# EAGLE design voltage_sensor_v0.6 (EAGLE 9.6.2)
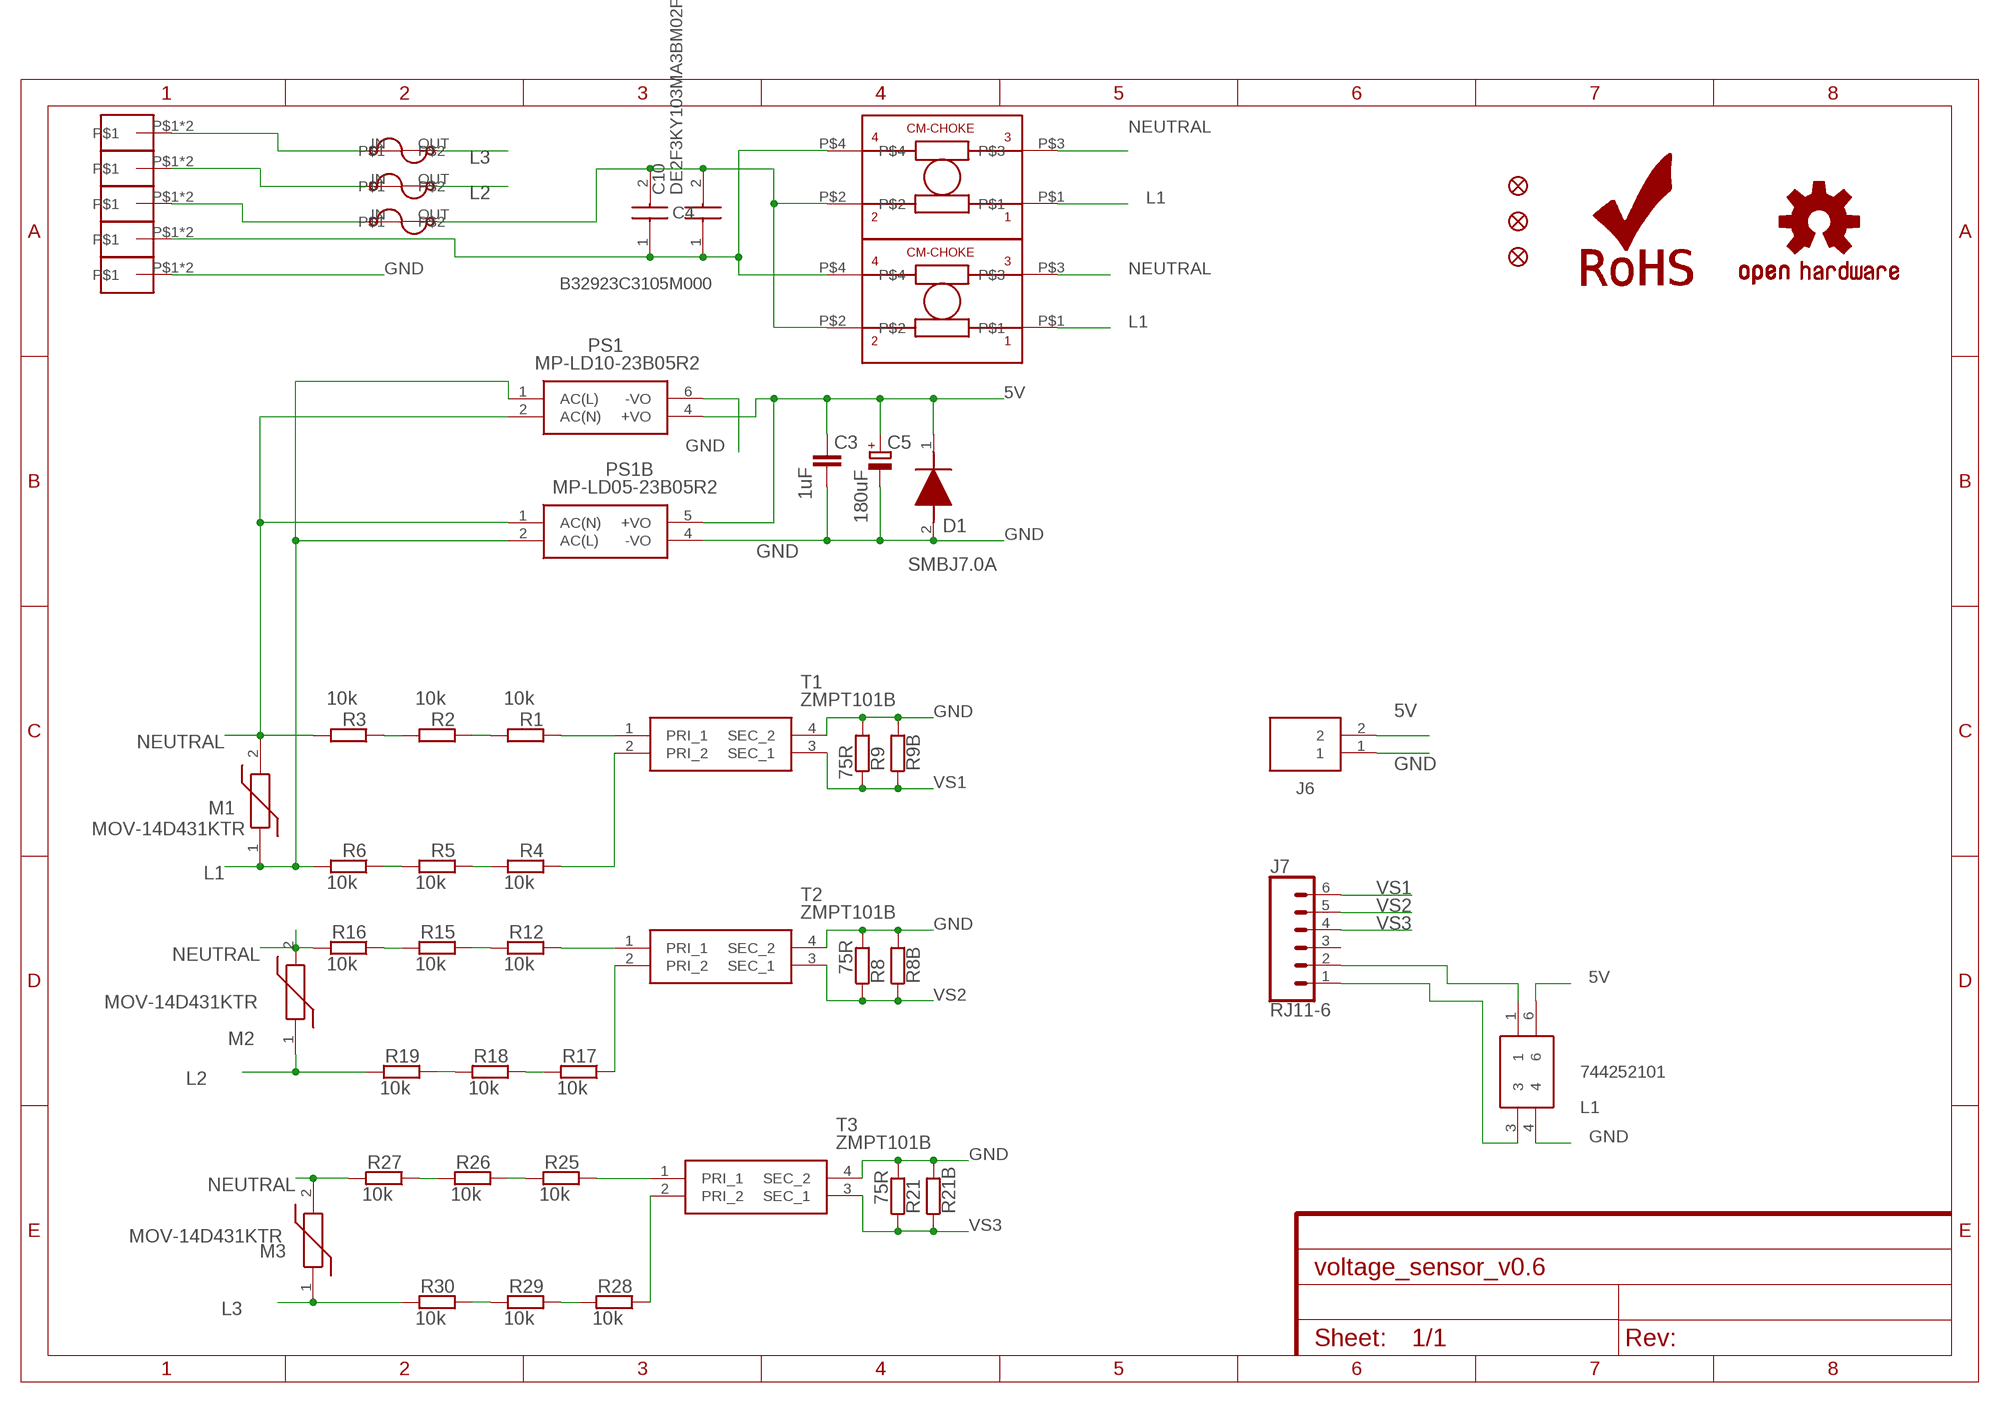
[diagram p0: schematic, sheet 1]

## Parts
C3  1uF  C-EUC0603  [C0603]
C4  B32923C3105M000  [B32923C_(26.5_X_12)]
C5  180uF  CPOL-EUC  [PANASONIC_C]
C10  DE2F3KY103MA3BM02F  [DE2F3KY103MA3BM02F]
D1  SMBJ7.0A  [DIOM5336X244N]
F1  2A/250V  BEL1AFUSE  [BELFUSE1A]
F2  2A/250V  BEL1AFUSE  [BELFUSE1A]
F3  2A/250V  BEL1AFUSE  [BELFUSE1A]
FD1  FIDUCIAL1X2  [FIDUCIAL-1X2]
FD2  FIDUCIAL1X2  [FIDUCIAL-1X2]
FD3  FIDUCIAL1X2  [FIDUCIAL-1X2]
J1  1905010  [1905010]
J3  1905010  [1905010]
J4  1905010  [1905010]
J5  1905010  [1905010]
J6  20020316-H021B01LF  [20020316H021B01LF]
J7  RJ11-6  [RJ11-6]
L1  744252101  [744252101]
LOGO1  ROHS_LOGO  [ROHS_LOGO_0.18_IN]
LOGO2  OSHW-LOGOS-COPPER  [OSHW-LOGO-S_COPPER]
M1  MOV-14D431KTR  [MOV14D431KTR]
M2  MOV-14D431KTR  [MOV14D431KTR]
M3  MOV-14D431KTR  [MOV14D431KTR]
PS1  MP-LD10-23B05R2  MP-LD10-23B12R2  [MPLD1023B12R2]
PS1B  MP-LD05-23B05R2  MP-LD05-23B03R2  [MPLD0523B03R2]
R1  10k  R-EU_R0603  [R0603]
R2  10k  R-EU_R0603  [R0603]
R3  10k  R-EU_R0603  [R0603]
R4  10k  R-EU_R0603  [R0603]
R5  10k  R-EU_R0603  [R0603]
R6  10k  R-EU_R0603  [R0603]
R8  75R  R-EU_R0603  [R0603]
R8B  R-EU_0204/7  [0204/7]
R9  75R  R-EU_R0603  [R0603]
R9B  R-EU_0204/7  [0204/7]
R12  10k  R-EU_R0603  [R0603]
R15  10k  R-EU_R0603  [R0603]
R16  10k  R-EU_R0603  [R0603]
R17  10k  R-EU_R0603  [R0603]
R18  10k  R-EU_R0603  [R0603]
R19  10k  R-EU_R0603  [R0603]
R21  75R  R-EU_R0603  [R0603]
R21B  R-EU_0204/7  [0204/7]
R25  10k  R-EU_R0603  [R0603]
R26  10k  R-EU_R0603  [R0603]
R27  10k  R-EU_R0603  [R0603]
R28  10k  R-EU_R0603  [R0603]
R29  10k  R-EU_R0603  [R0603]
R30  10k  R-EU_R0603  [R0603]
T1  ZMPT101B  [ZMPT101B]
T2  ZMPT101B  [ZMPT101B]
T3  ZMPT101B  [ZMPT101B]
U$1  47mH  RN114-0.3-02-47M  [RN114-0.3-02-47M]
U$1B  RN214-0.3-02-47M  [RN214-0.3-02-47M]
U$6  1905010  [1905010]

## Nets
5V: C3.1 C5.+ D1.1(K) J6.2 L1.6 PS1.4(+VO) PS1B.5(+VO)
GND: C3.2 C5.- D1.2(A) J1.P$1 J1.P$2 J6.1 L1.4 PS1.6(-VO) PS1B.4(-VO) R8.2 R8B.2 R9.2 R9B.2 R21.2 R21B.2 T1.4(SEC_2) T2.4(SEC_2) T3.4(SEC_2)
L1: M1.1 PS1.1(AC(L)) PS1B.2(AC(L)) R6.2 U$1.P$1 U$1B.P$1
L2: F2.OUT M2.1 R19.2
L3: F3.OUT M3.1 R30.2
N$1: R1.1 T1.1(PRI_1)
N$2: R4.1 T1.2(PRI_2)
N$3: R1.2 R2.1
N$4: R4.2 R5.1
N$5: R5.2 R6.1
N$6: R2.2 R3.1
N$7: F1.IN J3.P$1 J3.P$2
N$8: F2.IN J4.P$1 J4.P$2
N$10: R12.1 T2.1(PRI_1)
N$11: R17.1 T2.2(PRI_2)
N$12: R12.2 R15.1
N$13: R17.2 R18.1
N$14: R18.2 R19.1
N$15: R15.2 R16.1
N$16: F3.IN J5.P$1 J5.P$2
N$18: J7.2 L1.1
N$19: R25.1 T3.1(PRI_1)
N$20: R28.1 T3.2(PRI_2)
N$21: R25.2 R26.1
N$22: R28.2 R29.1
N$23: R29.2 R30.1
N$24: R26.2 R27.1
N$27: J7.1 L1.3
N$28: C4.1 C10.1 U$1.P$4 U$1B.P$4 U$6.P$1 U$6.P$2
N$29: C4.2 C10.2 F1.OUT U$1.P$2 U$1B.P$2
NEUTRAL: M1.2 M2.2 M3.2 PS1.2(AC(N)) PS1B.1(AC(N)) R3.2 R16.2 R27.2 U$1.P$3 U$1B.P$3
VS1: J7.6 R9.1 R9B.1 T1.3(SEC_1)
VS2: J7.5 R8.1 R8B.1 T2.3(SEC_1)
VS3: J7.4 R21.1 R21B.1 T3.3(SEC_1)
Unconnected: J7.3

## Library data of the parts
C3 = resistor:C-EU: CAPACITOR, European symbol
C4 = B32923C3105M000:B32923C3105M000: EPCOS - B32923C3105M000 - Safety Capacitor, 1 ?F, X2, B32923C Series, 305 V, Metallized PP Source: Datasheet <https://product.tdk.com/system/files/dam/doc/product/capacitor/film/emi/data_sheet/20/20/db/fc_2009/x2_b32921_928.pdf>; ARROW_PART_NUMBER: B32923C3105M000; ARROW_PRICE-STOCK: https://www.arrow.com/en/products/b32923c3105m000/epcos-tdk; DESCRIPTION: EPCOS - B32923C3105M000 - Safety Capacitor, 1 ?F, X2, B32923C Series, 305 V, Metallized PP; HEIGHT: mm; MANUFACTURER_NAME: TDK; MANUFACTURER_PART_NUMBER: B32923C3105M000
C5 = rcl:CPOL-EU: POLARIZED CAPACITOR, European symbol; SPICEPREFIX: C
C10 = DE2F3KY103MA3BM02F:DE2F3KY103MA3BM02F: Murata Single Layer Ceramic Capacitor SLCC 10nF 250Vrms +/-20% F Dielectric DE2 Series +85C Max Op. Temp. Source: Datasheet <https://psearch.en.murata.com/capacitor/product/DE2F3KY103MA3BM02F.html>; ARROW_PART_NUMBER: DE2F3KY103MA3BM02F; ARROW_PRICE-STOCK: https://www.arrow.com/en/products/de2f3ky103ma3bm02f/murata-manufacturing; DESCRIPTION: Murata Single Layer Ceramic Capacitor SLCC 10nF 250Vrms +/-20% F Dielectric DE2 Series +85C Max Op. Temp.; HEIGHT: 17mm; MANUFACTURER_NAME: Murata Electronics; MANUFACTURER_PART_NUMBER: DE2F3KY103MA3BM02F; MOUSER_PART_NUMBER: 81-DE2F3KY103MA3BM2F; MOUSER_PRICE-STOCK: https://www.mouser.co.uk/ProductDetail/Murata-Electronics/DE2F3KY103MA3BM02F?qs=coxMWmu44UCpS%2FqDCKay7w%3D%3D
D1 = SMBJ7.0A:SMBJ7.0A: TVS, SMD, 600W, 7V HY Electronic Corp SMBJ7.0A Uni-Directional TVS Diode, 600 (Min.)W peak, 2-Pin SMB Source: Datasheet; DESCRIPTION: TVS, SMD, 600W, 7V HY Electronic Corp SMBJ7.0A Uni-Directional TVS Diode, 600 (Min.)W peak, 2-Pin SMB; HEIGHT: 2.44mm; MANUFACTURER_NAME: HY Electronic Corp; MANUFACTURER_PART_NUMBER: SMBJ7.0A
F1-F3 = Qxd:BEL1AFUSE
FD1-FD3 = SparkFun-Aesthetics:FIDUCIAL: Fiducial Alignment Points Point-of-reference for pick-and-place machines and other optical instruments.
J1 J3-J5 U$6 = Phoenix-Contact-1905010:1905010: PCB terminal block, nominal current: 24 A, rated voltage (III/2): 400 V, nominal cross section: 2.5 mm 2 , number of potentials: 1, number of rows: 1, number of positions per row: 1, product range: ZFKDS(A) 2,5, pitch: 5.08 mm, connection method: Spring-cage connection, conductor/PCB connection direction: 45 °, color: green, Pin layout: Linear pinning, Solder pin [P]: 3.5 mm, number of solder pins per potential: 2, type of packaging: packed in cardboard. The article can be aligned to create different nos. of positions!
J6 = 20020316-H021B01LF:20020316-H021B01LF: Conn Pluggable Terminal Block 2 POS 5.08mm Screw RA Thru-Hole 16A/Contact Box Source: Datasheet <https://datasheet.datasheetarchive.com/originals/distributors/Datasheets-DGA18/1074774.pdf>; ARROW_PART_NUMBER: 20020316-H021B01LF; ARROW_PRICE-STOCK: https://www.arrow.com/en/products/20020316-h021b01lf/amphenol; DESCRIPTION: Conn Pluggable Terminal Block 2 POS 5.08mm Screw RA Thru-Hole 16A/Contact Box; HEIGHT: 13.8mm; MANUFACTURER_NAME: Amphenol; MANUFACTURER_PART_NUMBER: 20020316-H021B01LF; MOUSER_PART_NUMBER: N/A; MOUSER_PRICE-STOCK: https://www.mouser.co.uk/ProductDetail/Amphenol/20020316-H021B01LF?qs=W0yvOO0ixfFlV4eKhSWD3Q%3D%3D
J7 = SparkFun-Connectors:RJ11-6: RJ11 Jack - 6 pin Commonly found on CAT3 devices and some Microchip programmers. Here is the connector we sell at SparkFun: RJ11 6-Pin Connector <https://www.sparkfun.com/products/132> (PRT-00132) Datasheet <http://www.sparkfun.com/datasheets/Prototyping/Connectors/RJ11-Datasheet.pdf> It is used on this SparkFun product: SparkFun Weather Shield <https://www.sparkfun.com/products/12081> (DEV-12081) Weather Meters <https://www.sparkfun.com/products/8942> (SEN-08942); PROD_ID: CONN-08590; SF_ID: PRT-00132; VALUE: RJ11
L1 = 744252101:744252101: Common Mode Choke WE-SL3 2x100uH 0.5A Wurth WE-SL3 Series Wire-wound SMD Inductor with a Ferrite Core, 100 uH +50/-30 Bifilar Winding 500mA Idc Source: Datasheet <https://datasheet.datasheetarchive.com/originals/distributors/Datasheets_SAMA/813b8c68731e2e4ca9c504a5a5705204.pdf>; DESCRIPTION: Common Mode Choke WE-SL3 2x100uH 0.5A Wurth WE-SL3 Series Wire-wound SMD Inductor with a Ferrite Core, 100 uH +50/-30 Bifilar Winding 500mA Idc; HEIGHT: 2.5mm; MANUFACTURER_NAME: Wurth Elektronik; MANUFACTURER_PART_NUMBER: 744252101; MOUSER_PART_NUMBER: 710-744252101; MOUSER_PRICE-STOCK: https://www.mouser.co.uk/ProductDetail/Wurth-Elektronik/744252101?qs=T3oQrply3y%2FhsB6zILUctg%3D%3D
LOGO1 = SparkFun-Aesthetics:ROHS_LOGO: Restriction of Hazardous Substances (RoHS) Logo Logo for RoHS-certified hardware.
LOGO2 = SparkFun-Aesthetics:OSHW-LOGO: Open-Source Hardware (OSHW) Logo This logo indicates the piece of hardware it is found on incorporates a OSHW license and/or adheres to the definition of open source hardware found here: http://freedomdefined.org/OSHW
M1-M3 = MOV-14D431KTR:MOV-14D431KTR: Var MOV 275VAC/350VDC 4500A 430V Thru-Hole Radial T/R Source: Datasheet <https://componentsearchengine.com/Datasheets/2/MOV-14D431KTR.pdf>; ARROW_PART_NUMBER: MOV-14D431KTR; ARROW_PRICE-STOCK: https://www.arrow.com/en/products/mov-14d431ktr/bourns; DESCRIPTION: Var MOV 275VAC/350VDC 4500A 430V Thru-Hole Radial T/R; HEIGHT: 20mm; MANUFACTURER_NAME: Bourns; MANUFACTURER_PART_NUMBER: MOV-14D431KTR; MOUSER_PART_NUMBER: 652-MOV-14D431KTR; MOUSER_PRICE-STOCK: https://www.mouser.co.uk/ProductDetail/Bourns/MOV-14D431KTR?qs=CQ3B1E%252BbPs0ZvUvqcBsPRw%3D%3D
PS1 = MP-LD10-23B12R2:MP-LD10-23B12R2: MULTICOMP PRO - MP-LD10-23B05R2 - AC/DC PCB Mount Power Supply (PSU), 100 to 430VDC, ITE, Household, Medical & Transformers, 5V Output Source: Datasheet <https://componentsearchengine.com/Datasheets/2/MP-LD10-23B05R2.pdf>; DESCRIPTION: MULTICOMP PRO - MP-LD10-23B12R2 - AC/DC PCB Mount Power Supply (PSU), 100 to 430VDC, ITE, Household, Medical & Transformers, 1 Output; HEIGHT: 21.5mm; MANUFACTURER_NAME: MULTICOMP; MANUFACTURER_PART_NUMBER: MP-LD10-23B05R2
PS1B = MP-LD05-23B03R2:MP-LD05-23B03R2: POWER SUPPLY, AC-DC, 3.3V, 1.515A Source: Datasheet <https://www.farnell.com/datasheets/3167202.pdf>; DESCRIPTION: POWER SUPPLY, AC-DC, 3.3V, 1.515A; HEIGHT: 18.1mm; MANUFACTURER_NAME: MULTICOMP; MANUFACTURER_PART_NUMBER: MP-LD05-23B03R2
R1-R6 R8 R8B R9 R9B R12 R15-R19 R21 R21B R25-R30 = rcl:R-EU_: RESISTOR, European symbol
T1-T3 = ZMPT101B:ZMPT101B: Current-type Voltage Transformer Source: Datasheet; DESCRIPTION: Current-type Voltage Transformer; HEIGHT: 18.8mm; MANUFACTURER_NAME: Qingxian Zeming Langxi Electronic; MANUFACTURER_PART_NUMBER: ZMPT101B
U$1 = Schaffner-CM-Choke:RN114-0.3-02-47M
U$1B = Schaffner-CM-Choke:RN214-0.3-02-47M

## Net classes
0 default: clearance 0.205 mm
1 power: width 0.305 mm, drill 0.6 mm, clearance 0.254 mm
2 gnd: width 0.254 mm, drill 0.6 mm, clearance 0.254 mm

## Board
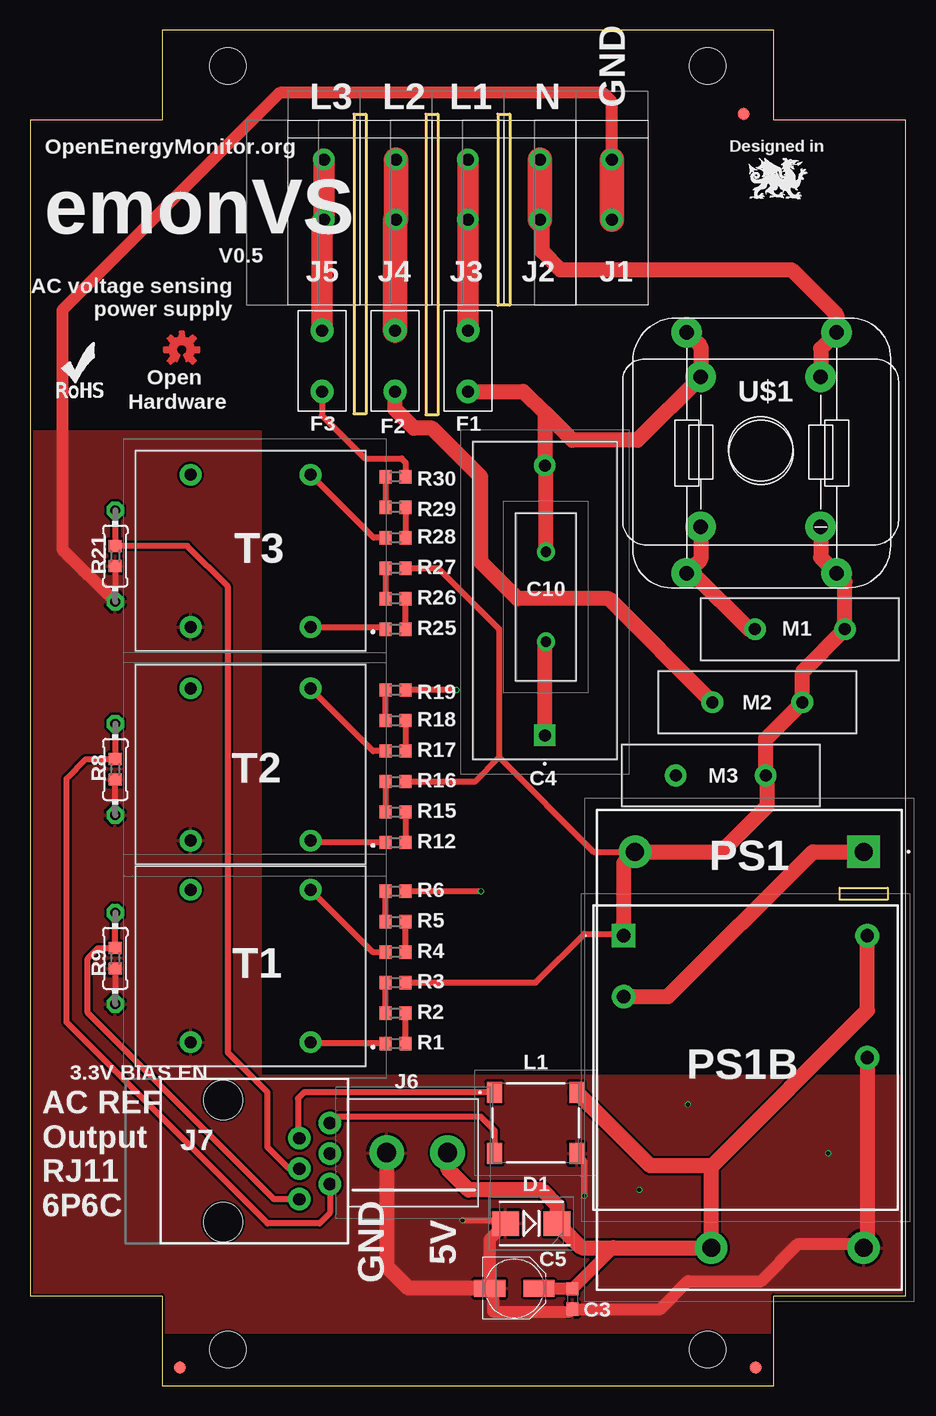
[diagram p1: board, top side]
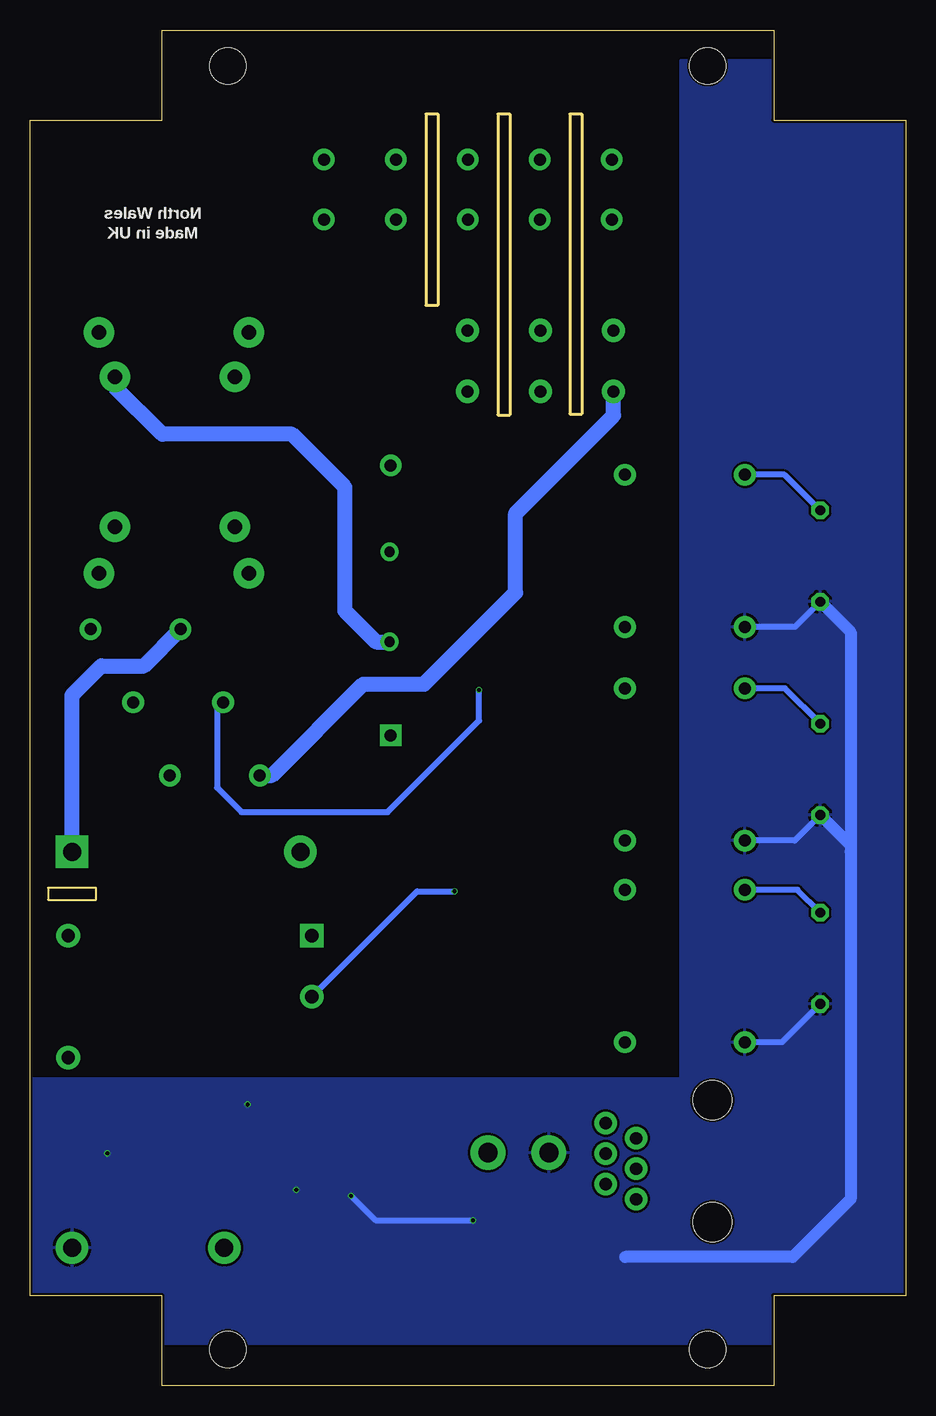
[diagram p2: board, bottom side, seen from below]

Size 73 x 113 mm. Coordinates in mm from the lower left corner, seen from the top.
Outline: 0,7.5 11,7.5 11,0 62,0 62,7.5 73,7.5 73,105.5 62,105.5 62,113 11,113 11,105.5 0,105.5 0,7.5
Copper layers (1*16): Top 0.035mm / dielectric 1.6mm / Bottom 0.035mm
Design rules "jlcpcb-2layers": minimum track width 5mil, minimum drill 0.3mm, track to track 5mil, track to pad 5mil, pad to pad 5mil, via to via 5mil, smd to smd 5mil, copper to edge 0.2mm, drill to drill 6mil, minimum pad ring 10mil, minimum via ring 3mil, stop-mask expansion 4mil, vias tented up to drill 0mil, thermal gap 10mil
Holes 3 mm at 16.5,3 16.5,110 56.5,3 56.5,110
tKeepout: area 13.5,0 to 19.5,6; area 53.5,0 to 59.5,6; area 53.5,107 to 59.5,113; area 13.5,107 to 19.5,113; area 25,108.5 to 48.5,113; area 25,0 to 48.5,4.5
Milling: 16 lines

### Footprints (pad centres in the part's own frame; a part is rotated, then mirrored left to right if it is on the bottom)
C0603 = smd 1.1 x 1: 1 -0.85,0; 2 0.85,0
B32923C_(26.5_X_12) = drill 1 pad 1.5 square: 1 0,0 | drill 1 pad 1.5: 2 22.5,0
PANASONIC_C = smd 2.6 x 1.4: + 2.05,0; - -2.05,0
DE2F3KY103MA3BM02F = drill 0.85 pad 1.381: 1 0,0; 2 7.5,0
DIOM5336X244N = smd 2.25 x 2.05: 1 -2.15,0; 2 2.15,0
BELFUSE1A = drill 1 pad 1.93: IN 2,1.66; OUT 2,6.74
FIDUCIAL-1X2 = smd 1 x 1: 1 0,0
1905010 = drill 1: P$1 3,3.3; P$2 3,8.3
20020316H021B01LF = drill 1.6 pad 2.4: 1 0,0; 2 5.08,0
RJ11-6 = drill 1.016 pad 1.88: 1 -3.175,8.89; 2 -1.905,6.35; 3 -0.635,8.89; 4 0.635,6.35; 5 1.905,8.89; 6 3.175,6.35 | hole 3.251: -5.08,0; 5.08,0
744252101 = smd 1.78 x 1.27: 1 -2.54,-3.43; 3 2.54,-3.43; 4 2.54,3.43; 6 -2.54,3.43
MOV14D431KTR = drill 1 pad 1.5: 1 0,0; 2 7.5,0
MPLD1023B12R2 = drill 1.5 pad 2.25 square: 1 0,0 | drill 1.5 pad 2.25: 2 0,-19.05; 4 33.02,-12.705; 6 33.02,0
MPLD0523B03R2 = drill 1.1 pad 1.65 square: 1 0,0 | drill 1.1 pad 1.65: 2 0,-5.08; 4 20.32,-10.16; 5 20.32,0
R0603 = smd 1 x 1.1: 1 -0.85,0; 2 0.85,0
0204/7 = drill 0.813 octagon: 1 -3.81,0; 2 3.81,0
ZMPT101B = drill 1 pad 1.5: 1 0,0; 2 0,-12.7; 3 10,-12.7; 4 10,0
RN114-0.3-02-47M = drill 1.2 pad 2.54: P$1 9.87,-5.66; P$2 -10.23,-5.66; P$3 9.87,6.84; P$4 -10.23,6.84
RN214-0.3-02-47M = drill 1.2 pad 2.54: P$1 14,6.5; P$2 1.5,6.5; P$3 14,16.5; P$4 1.5,16.5

### Placement (x,y rotation side)
C3  45.22,7.22 270 top
C4  42.92,54.2 90 top
C5  40.38,8.11 0 top
C10  43.02,62 90 top
D1  41.81,13.5 180 top
F1  38.52,89.61 180 top
F2  32.44,89.61 180 top
F3  26.35,89.61 180 top
FD1  12.5,1.5 0 top
FD2  60.5,1.5 0 top
FD3  59.5,106 0 top
J1  51.5,105.5 180 top
J3  39.5,105.5 180 top
J4  33.5,105.5 180 top
J5  27.5,105.5 180 top
J6  29.73,19.41 0 top
J7  16.11,18.7 270 top
L1  42.16,21.9 270 top
LOGO1  2.02,82.24 0 top
LOGO2  12.65,86.35 0 top
M1  60.45,63.05 0 top
M2  56.9,56.95 0 top
M3  53.85,50.86 0 top
PS1  69.5,44.5 270 top
PS1B  49.5,37.5 0 top
R1  30.48,28.5 0 top
R2  30.48,31.04 180 top
R3  30.48,33.58 0 top
R4  30.48,36.12 0 top
R5  30.48,38.66 180 top
R6  30.48,41.2 0 top
R8  7.11,51.36 270 top
R8B  7.11,51.36 270 top
R9  7.11,35.62 270 top
R9B  7.11,35.62 270 top
R12  30.48,45.27 0 top
R15  30.48,47.81 180 top
R16  30.48,50.35 0 top
R17  30.48,52.89 0 top
R18  30.48,55.43 180 top
R19  30.48,57.97 0 top
R21  7.11,69.14 270 top
R21B  7.11,69.14 270 top
R25  30.48,63.05 0 top
R26  30.48,65.59 180 top
R27  30.48,68.13 0 top
R28  30.48,70.67 0 top
R29  30.48,73.21 180 top
R30  30.48,75.75 0 top
T1  23.39,28.62 180 top
T2  23.39,45.42 180 top
T3  23.39,63.23 180 top
U$1  60.42,77.57 270 top
U$1B  49.42,85.57 270 top
U$6  45.5,105.5 180 top

### Tracks (layer width: path | path; a pad name or v marks a point on that pad's centre or on a via)
5V
  Top 1.016: 48.63,11.48 C3.1 45.18,8.11 C5.+
  Top 1.27: 56.8,18.24 PS1.4 48.63,11.48 45.98,11.48 D1.1 43.96,15.03 42.67,16.31 36.58,16.31 34.81,18.07 J6.2 | PS1B.5 69.82,31.27 56.8,18.24 | L1.6 51.69,18.34 56.69,18.34 56.8,18.24
GND  (via drill 0.35)
  Top 0.508: L1.4 46.23,18.73 v46.23,15.8 | v36.07,13.77 39.39,13.77 D1.2 | R9.2 R9B.2 | 6.86,47.3 R8B.2 R8.2 | R21.2 R21B.2 6.86,65.08
  Top 1.016: 69.82,11.8 64.07,11.8 60.96,8.69 54.86,8.69 52.54,6.37 C3.2 45,6.15 38.61,6.15 38.61,7.84 C5.- 38.33,12.18 D1.2 | J1.P$1 48.5,107 47.75,107.75 20.83,107.75 2.71,89.63 2.71,69.74 R21B.2
  Top 1.27: PS1B.4 69.82,11.8 PS1.6 | J6.1 29.73,9.95 31.57,8.11 C5.-
  Top 2.032: J1.P$1 J1.P$2
  Bottom 0.508: v46.23,15.8 44.2,13.77 v36.07,13.77 | R9B.2 10.29,28.62 T1.4 | R8B.2 9.25,45.42 T2.4 | R21B.2 9.21,63.23 T3.4
  Bottom 1.016: R21B.2 4.57,62.79 4.57,45.01 | 23.37,10.72 9.4,10.72 4.57,15.55 4.57,44.51 4.57,45.01 | R8B.2 4.57,45.01
  other vias: 50.8,16.31 54.86,23.42 66.55,19.36
  pour Top: -3,79.5 -3,4.5 77,4.5 77,25.79 19.23,25.79 19.23,79.5
  pour Bottom: -4,111.5 -4,3.5 78,3.5 78,25.59 18.72,25.59 18.72,110.5 6,110.5 5,111.5
L1  (via drill 0.35)
  Top 0.508: v37.59,41.2 R6.2
  Top 1.27: U$1B.P$1 55.92,68.86 U$1.P$1 55.27,67.7 59.92,63.05 M1.1 | PS1B.2 53.19,32.42 65.27,44.5 PS1.1
  Bottom 0.508: PS1B.2 40.72,41.2 v37.59,41.2
  Bottom 1.27: PS1.1 69.5,57.56 67.06,60 63.5,60 M1.1
L2  (via drill 0.35)
  Top 0.508: v35.56,57.97 R19.2
  Top 1.27: M2.1 48.26,65.59 40.64,65.59 37.59,68.64 37.59,75.75 33.53,79.81 32,79.81 30.44,81.38 F2.OUT
  Bottom 0.508: M2.1 57.4,56.44 57.4,49.84 55.37,47.81 43.18,47.81 35.56,55.43 v35.56,57.97
L3
  Top 0.508: F3.OUT 24.35,80.86 27.94,77.27 30.99,77.27 31.33,76.93 R30.2
  Bottom 1.27: M3.1 52.83,50.86 45.21,58.48 40.13,58.48 32.51,66.1 32.51,72.7 24.35,80.86 F3.OUT
N$1
  Top 0.508: R1.1 23.51,28.5 T1.1
N$2
  Top 0.508: R4.1 28.59,36.12 T1.2
N$3
  Top 0.508: R1.2 R2.1
N$4
  Top 0.508: R4.2 R5.1
N$5
  Top 0.508: R5.2 R6.1
N$6
  Top 0.508: R2.2 R3.1
N$7
  Top 1.27: 36.52,97.18 J3.P$2
  Top 1.778: F1.IN 36.52,97.18 | J3.P$2 J3.P$1
N$8
  Top 2.032: J4.P$1 J4.P$2 30.44,97.14 F2.IN
N$10
  Top 0.508: R12.1 23.54,45.27 T2.1
N$11
  Top 0.508: R17.1 28.62,52.89 T2.2
N$12
  Top 0.508: R15.1 R12.2
N$13
  Top 0.508: R18.1 R17.2
N$14
  Top 0.508: R18.2 R19.1
N$15
  Top 0.508: R16.1 R15.2
N$16
  Top 1.778: F3.IN 24.35,97.05 J5.P$2 J5.P$1
N$18
  Top 0.508: L1.1 22.86,24.44 22.35,23.93 22.35,20.72 J7.2
N$19
  Top 0.508: T3.1 29.45,63.23 R25.1
N$20
  Top 0.508: R28.1 28.66,70.67 T3.2
N$21
  Top 0.508: R25.2 R26.1
N$22
  Top 0.508: R29.1 R28.2
N$23
  Top 0.508: R30.1 R29.2
N$24
  Top 0.508: R27.1 R26.2
N$27
  Top 0.508: L1.3 38.73,21.27 37.59,22.41 25.53,22.41 J7.1
N$28
  Top 1.27: C4.1 42.92,61.9 C10.1 | U$1B.P$4 65.92,86.46 U$1.P$4 67.26,89.26 63.5,93.02 44.2,93.02 42.67,94.54 42.67,97.03 U$6.P$2
  Top 2.032: U$6.P$1 U$6.P$2
  Bottom 1.27: C10.1 44.16,62 46.74,64.57 46.74,74.88 51.16,79.3 61.98,79.3 65.92,83.25 U$1B.P$4
N$29
  Top 1.27: F1.OUT 41.14,82.87 42.92,81.08 | 42.92,81.08 C4.2 43.02,76.6 C10.2 | 42.92,81.08 45.21,78.8 50.65,78.8 U$1B.P$2 55.92,86.64 U$1.P$2
NEUTRAL
  Top 0.508: R27.2 34.04,68.13 39.12,63.05 39.12,52.38 | 39.12,52.38 47,44.5 PS1.2 | R16.2 37.08,50.35 39.12,52.38 | R3.2 42.16,33.58 46.23,37.65 49.35,37.65 PS1B.1
  Top 1.27: U$1B.P$3 65.92,69.04 U$1.P$3 67.95,67.01 M1.2 64.4,59.49 M2.2 61.35,53.9 M3.2 61.47,50.74 61.47,48.32 57.65,44.5 PS1.2 49.5,43.55 PS1B.1
VS1
  Top 0.508: J7.6 20.34,15.53 4.83,31.04 4.83,35.62 5.68,36.47 R9.1 R9B.1
  Bottom 0.508: R9B.1 9.01,41.32 T1.3
VS2
  Top 0.508: R8B.1 R8.1 4.66,52.21 3.05,50.6 3.05,30.28 19.81,13.52 24.13,13.52 25,14.39 J7.5
  Bottom 0.508: R8B.1 10.06,58.12 T2.3
VS3
  Top 0.508: J7.4 21.61,18.07 19.81,19.87 19.81,24.44 16.51,27.74 16.51,66.6 13.12,69.99 R21.1 R21B.1
  Bottom 0.508: R21B.1 10.09,75.93 T3.3

### Text on the board
tNames: L3 | L2 | L1 | N | GND | OpenEnergyMonitor.org | Designed in | emonVS | V0.5 | AC voltage sensing / power supply | J5 | J4 | J3 | J2 | J1 | Open | Hardware | U$1 | J7 | AC REF / Output / RJ11 / 6P6C | 5V | GND
bNames: North Wales | Made in UK
tSilk: 3.3V BIAS EN